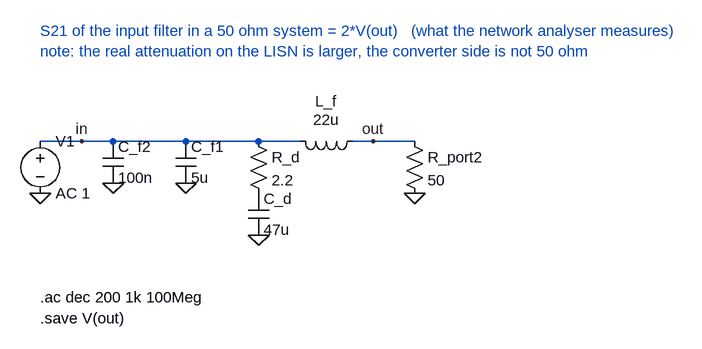
[diagram p0: schematic Filter_S21.asc]
Filter_S21.asc, the LTspice schematic file:
Version 4
SHEET 1 2200 1000
SYMBOL voltage 0 -16 R0
SYMATTR InstName V1
SYMATTR Value AC 1
SYMATTR SpiceLine Rser=50
FLAG 0 80 0
WIRE 0 0 64 0
FLAG 64 0 in
WIRE 64 0 400 0
SYMBOL cap 96 0 R0
SYMATTR InstName C_f2
SYMATTR Value 100n
SYMATTR SpiceLine Rser=20m Lser=0.5n
FLAG 112 64 0
SYMBOL cap 208 0 R0
SYMATTR InstName C_f1
SYMATTR Value 5u
SYMATTR SpiceLine Rser=5m Lser=1n
FLAG 224 64 0
SYMBOL res 320 -16 R0
SYMATTR InstName R_d
SYMATTR Value 2.2
SYMBOL cap 320 80 R0
SYMATTR InstName C_d
SYMATTR Value 47u
SYMATTR SpiceLine Rser=0.5
FLAG 336 144 0
SYMBOL ind 496 -16 R90
WINDOW 0 -30 56 VBottom 2
WINDOW 3 -2 56 VBottom 2
SYMATTR InstName L_f
SYMATTR Value 22u
SYMATTR SpiceLine Rser=100m Cpar=5p Rpar=5k
WIRE 480 0 576 0
FLAG 512 0 out
SYMBOL res 560 -16 R0
SYMATTR InstName R_port2
SYMATTR Value 50
FLAG 576 80 0
TEXT 0 240 Left 2 !.ac dec 200 1k 100Meg
TEXT 0 272 Left 2 !.save V(out)
TEXT 0 -170 Left 2 ;S21 of the input filter in a 50 ohm system = 2*V(out)   (what the network analyser measures)\nnote: the real attenuation on the LISN is larger, the converter side is not 50 ohm

The netlist it stands for:
* Filter_S21.asc
V1 in 0 AC 1 Rser=50
C_f2 in 0 100n Rser=20m Lser=0.5n
C_f1 in 0 5u Rser=5m Lser=1n
R_d in P001 2.2
C_d P001 0 47u Rser=0.5
L_f out in 22u Rser=100m Cpar=5p Rpar=5k
R_port2 out 0 50
.ac dec 200 1k 100Meg
.save V(out)
* S21 of the input filter in a 50 ohm system = 2*V(out)   (what the network analyser measures)
* note: the real attenuation on the LISN is larger, the converter side is not 50 ohm
.backanno
.end